# EAGLE schematic breakout-lrtb-g6tg_light (EAGLE 6.5.0)
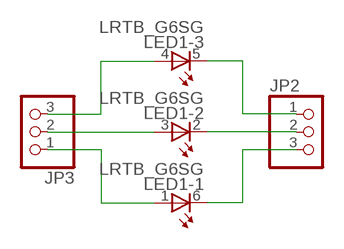
[diagram p0: schematic, sheet 1]

## Parts
JP2  PINHD-1X3  [1X03]
JP3  PINHD-1X3  [1X03]
LED1  LRTB_G6SG  [LRTB_G6SG]

## Nets
N$4: JP3.2 LED1.3(-2:A)
N$5: JP3.3 LED1.4(-3:A)
N$6: JP3.1 LED1.1(-1:A)
N$7: JP2.3 LED1.6(-1:C)
N$8: JP2.1 LED1.5(-3:C)
N$9: JP2.2 LED1.2(-2:C)

## Library data of the parts
JP2 JP3 = pinhead:PINHD-1X3: PIN HEADER
LED1 = led:LRTB_G6SG: LRTB G6SG 6-lead TOPLED® Source: OSRAM Opto Semiconductors ... LRTB_G6SG_Pb_free.pdf